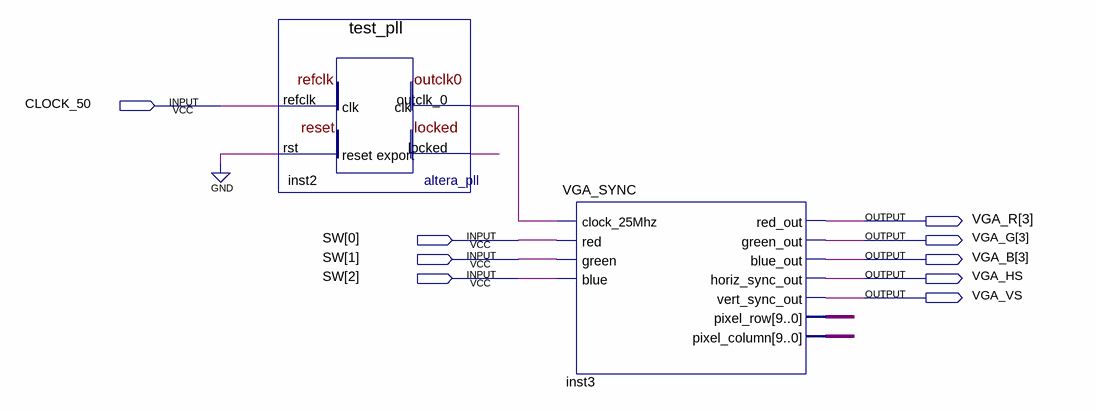
[diagram p0: schematic sheet]
// Quartus schematic BackgroundColourTest.bdf as structural Verilog: 2 symbols, 9 pins
module BackgroundColourTest (
  input  CLOCK_50,
  input  [2:0] SW,
  output [3:3] VGA_R,
  output [3:3] VGA_G,
  output [3:3] VGA_B,
  output VGA_HS,
  output VGA_VS
);

  wire inst2_locked, inst2_outclk_0;
  wire [9:0] inst3_pixel_column, inst3_pixel_row;

  test_pll inst2 (.refclk(CLOCK_50), .rst(1'b0), .outclk_0(inst2_outclk_0), .locked(inst2_locked));
  VGA_SYNC inst3 (
    .clock_25Mhz(inst2_outclk_0), .red(SW[0]), .green(SW[1]), .blue(SW[2]), .red_out(VGA_R[3]),
    .green_out(VGA_G[3]), .blue_out(VGA_B[3]), .horiz_sync_out(VGA_HS), .vert_sync_out(VGA_VS),
    .pixel_row(inst3_pixel_row), .pixel_column(inst3_pixel_column));
endmodule
